# EAGLE design BandpassedGainAmpThruholeMounthole (EAGLE 9.5.1)
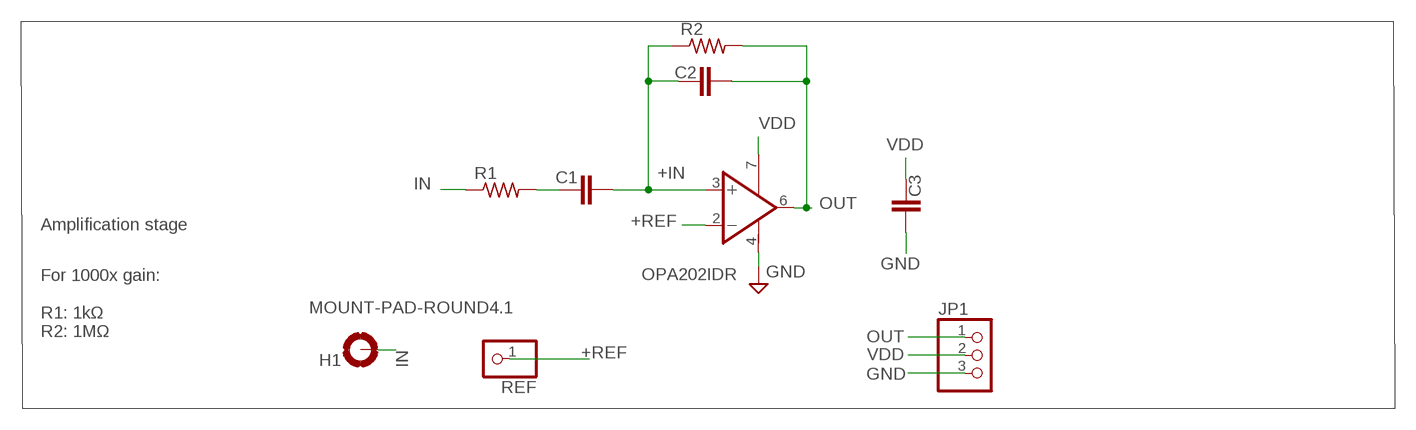
[diagram p0: schematic, sheet 1]

## Parts
C1  C2.5/2  [C2.5-2]
C2  C2.5/2  [C2.5-2]
C3  C2.5/2  [C2.5-2]
H1  MOUNT-PAD-ROUND4.1  [4,1-PAD]
JP1  PINHD-1X3  [1X03]
R1  R-US_0204/5  [0204/5]
R2  R-US_0204/5  [0204/5]
REF  PINHD-1X1  [1X01]
U1  OPA202IDR  [SOIC127P600X175-8N]

## Nets
+IN: C1.2 C2.1 R2.1 U1.3(A:+IN)
+REF: REF.1 U1.2(A:-IN)
GND: C3.2 JP1.3 U1.4(SUPP:V-)
IN: H1.B4,1(MOUNT) R1.1
OUT: C2.2 JP1.1 R2.2 U1.6(A:OUT)
R1C1: C1.1 R1.2
VDD: C3.1 JP1.2 U1.7(SUPP:V+)

## Notes on the sheet
- Amplification stage
- For 1000x gain:
  
  R1: 1kΩ
  R2: 1MΩ

## Library data of the parts
C1-C3 = capacitor-wima:C: CAPACITOR naming: grid - package width
H1 = holes:MOUNT-PAD-ROUND: MOUNTING PAD, round
JP1 = pinhead:PINHD-1X3: PIN HEADER
R1 R2 = rcl:R-US_: RESISTOR, American symbol; SPICEPREFIX: R
REF = pinhead:PINHD-1X1: PIN HEADER
U1 = OPA202IDR:OPA202IDR: OPAx202 Precision, Low-Noise, Heavy Capacitive Drive, 36-V Operational Amplifiers Source: Datasheet <https://www.ti.com/lit/ds/symlink/opa202.pdf?HQS=dis-dk-null-digikeymode-dsf-pf-null-wwe&ts=1654259980940&ref_url=https%253A%252F%252Fwww.ti.com%252Fgeneral%252Fdocs%252Fsuppproductinfo.tsp%253FdistId%253D10%2526gotoUrl%253Dhttps%253A%252F%252Fwww.ti.com%252Flit%252Fgpn%252Fopa202> Check availability <https://pricing.snapeda.com/parts/OPA202IDR/Texas%20Instruments/view-part?ref=eda>; AVAILABILITY: In Stock; CHECK_PRICES: https://www.snapeda.com/parts/OPA202IDR/Texas+Instruments/view-part/?ref=eda; DESCRIPTION: Low-noise (0.2 µVPP, 9 nV/√Hz) heavy-capacitive-drive (25 nF) super-beta precision op amp; MF: Texas Instruments; MP: OPA202IDR; PACKAGE: SOIC-8 Texas Instruments; PRICE: None; PURCHASE-URL: https://www.snapeda.com/api/url_track_click_mouser/?unipart_id=4806048&manufacturer=Texas Instruments&part_name=OPA202IDR&search_term=opa202; SNAPEDA_LINK: https://www.snapeda.com/parts/OPA202IDR/Texas+Instruments/view-part/?ref=snap

## Board
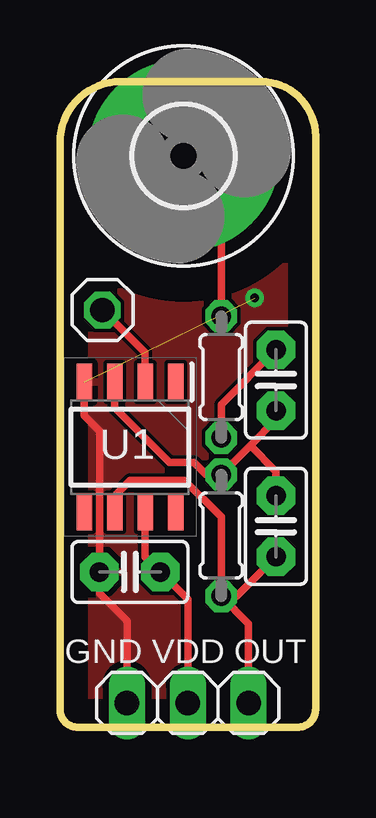
[diagram p1: board, top side]
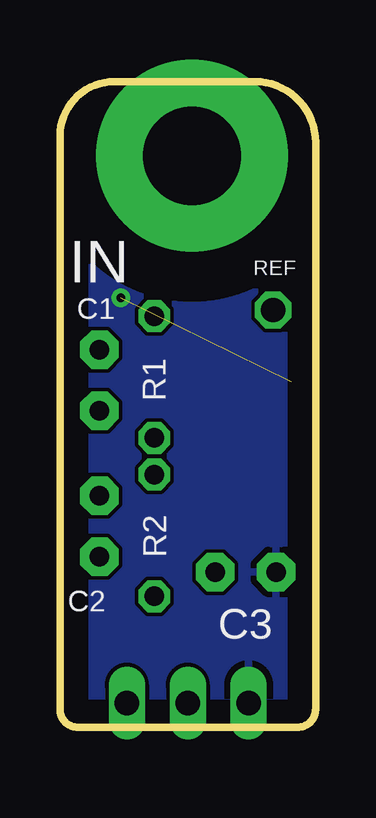
[diagram p2: board, bottom side, seen from below]

Size 10.67 x 26.92 mm. Coordinates in mm from the lower left corner, seen from the top.
Outline: 9.91,0 0.76,0 arc-90 0,0.76 0,24.38 arc-90 2.54,26.92 8.38,26.92 arc-90 10.67,24.64 10.67,0.76 arc-90 9.91,0
Copper layers (1*16): Top 0.035mm / dielectric 1.5mm / Bottom 0.035mm
Design rules "default": minimum track width 6mil, minimum drill 0.35mm, track to track 6mil, track to pad 6mil, pad to pad 6mil, via to via 6mil, smd to smd 6mil, copper to edge 40mil, drill to drill 6mil, minimum pad ring 10mil, minimum via ring 8mil, stop-mask expansion 4mil, vias tented up to drill 0mil, thermal gap 10mil

### Footprints (pad centres in the part's own frame; a part is rotated, then mirrored left to right if it is on the bottom)
C2.5-2 = drill 0.813 pad 1.6 octagon: 1 -1.27,0; 2 1.27,0
4,1-PAD = drill 4.1 pad 8: B4,1 0,0
1X03 = drill 1.016 long: 1 -2.54,0; 2 0,0; 3 2.54,0
0204/5 = drill 0.813 octagon: 1 -2.54,0; 2 2.54,0
1X01 = drill 1.016 octagon: 1 0,0
SOIC127P600X175-8N = smd 1.528 x 0.65: 1 -2.711,1.905; 2 -2.711,0.635; 3 -2.711,-0.635; 4 -2.711,-1.905; 5 2.711,-1.905; 6 2.711,-0.635; 7 2.711,0.635; 8 2.711,1.905

### Placement (x,y rotation side)
C1  9.02,14.48 270 top
C2  9.02,8.38 270 top
C3  2.92,6.48 180 top
H1  5.16,23.83 0 top
JP1  5.33,1.02 180 top
R1  6.73,14.6 270 top
R2  6.73,8 270 top
REF  1.78,17.4 0 top
U1  2.92,11.68 270 top

### Tracks (layer width: path | path; a pad name or v marks a point on that pad's centre or on a via)
+IN
  Top 0.305: C1.2 9.02,12.83 7.94,11.75 | 7.94,11.75 R2.1 6.1,10.54 5.59,11.05 4.57,11.05 2.29,13.33 U1.3 | C2.1 9.02,10.67 7.94,11.75
+REF
  Top 0.305: REF.1 3.56,15.62 U1.2
GND  (via drill 0.35)  (1 unrouted)
  Top 0.305: U1.4 1.02,13 1.65,12.36 C3.2 1.65,5.59 2.79,4.45 JP1.3
  other vias: 8.13,17.91
  pour Top: -0.89,-0.64 11.43,-0.64 11.43,28.32 -0.89,28.32
  pour Bottom: -0.64,-0.51 -0.64,28.45 11.05,28.45 11.05,-0.51
IN
  Top 0.305: H1.B4,1 6.73,22.25 R1.1
OUT
  Top 0.305: C2.2 7.37,5.46 R2.2 | U1.6 2.29,9.65 2.92,10.29 5.21,10.29 6.73,8.76 R2.2 | R2.2 7.87,4.32 JP1.1
R1C1
  Top 0.305: R1.2 6.73,13.46 C1.1
VDD
  Top 0.305: 3.56,8.51 U1.7 3.56,7.11 C3.1 5.33,5.33 JP1.2

### Text on the board
tNames: GND VDD OUT
bNames: IN